# Altium schematic sheet ADS8686S_BLOCK_B.SchDoc
size A4; SheetNumber: 13; SheetTotal: 14
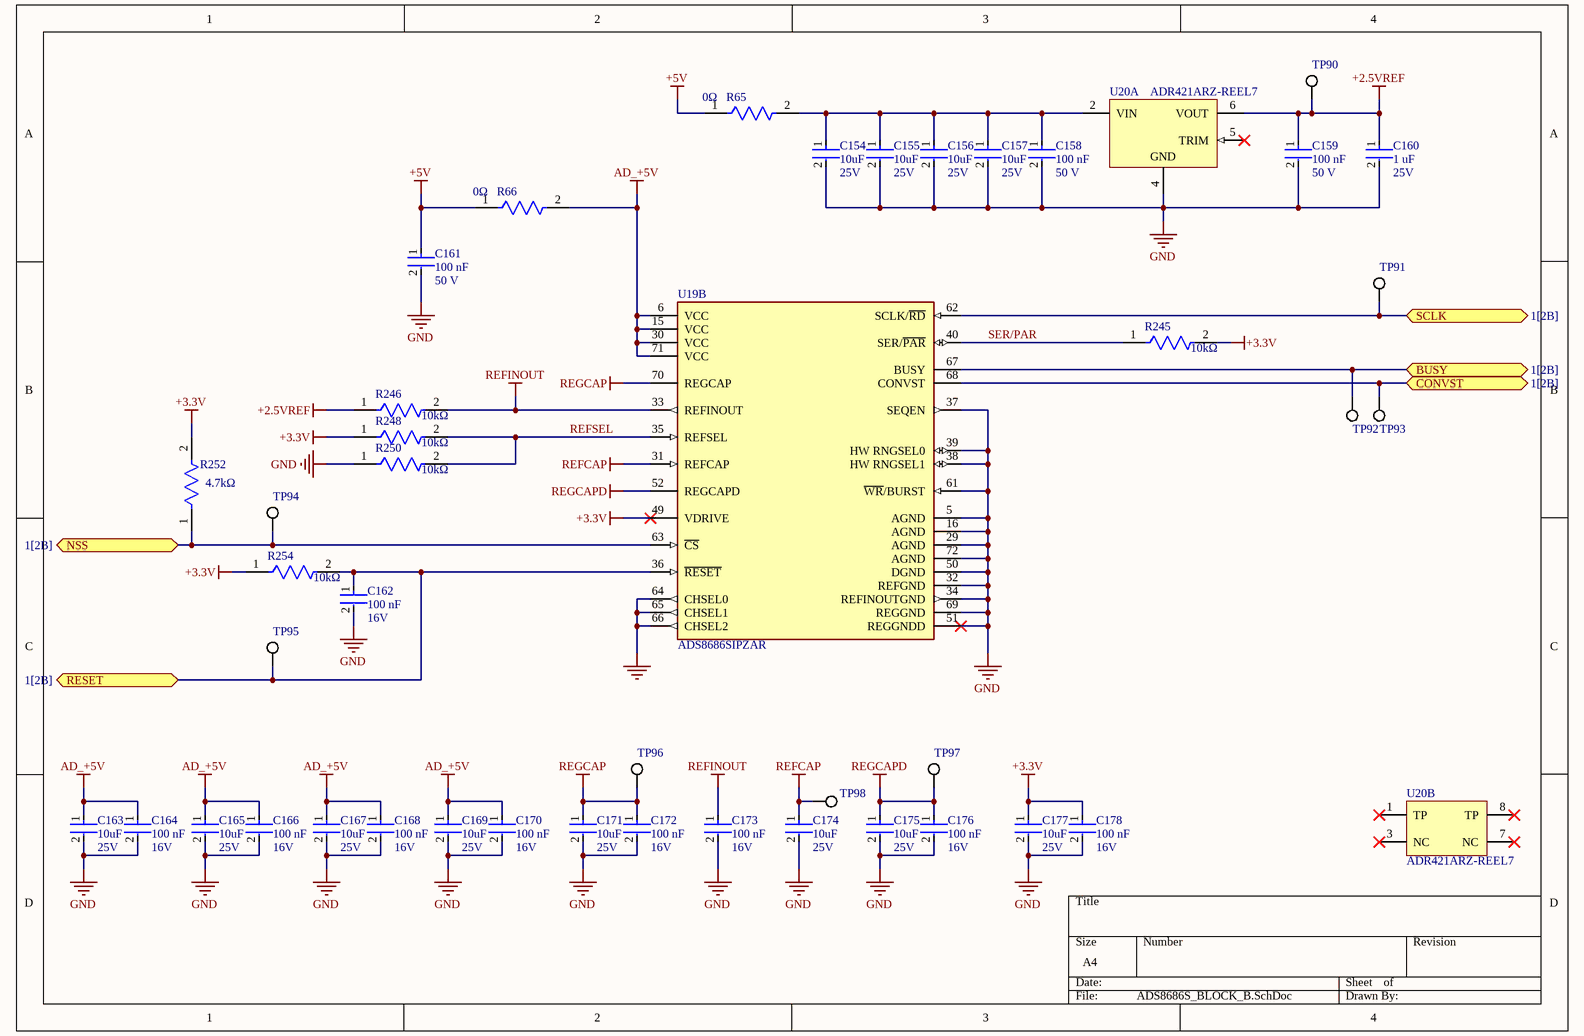
[diagram p0: ADS8686S_BLOCK_B.SchDoc]

## Parts
C154  Voltage Rating: 25V  Capacitance: 10uF  [FP-C1608-080-IPC_B]  (hidden comment: C1608X5R1E106M080AC)
C155  Voltage Rating: 25V  Capacitance: 10uF  [FP-C1608-080-IPC_B]  (hidden comment: C1608X5R1E106M080AC)
C156  Voltage Rating: 25V  Capacitance: 10uF  [FP-C1608-080-IPC_B]  (hidden comment: C1608X5R1E106M080AC)
C157  Voltage Rating: 25V  Capacitance: 10uF  [FP-C1608-080-IPC_B]  (hidden comment: C1608X5R1E106M080AC)
C158  value 100 nF  Voltage Rating: 50 V  [FP-C0603C-CF-IPC_B]  (hidden comment: C0603C104M5RACTU)
C159  value 100 nF  Voltage Rating: 50 V  [FP-C0603C-CF-IPC_B]  (hidden comment: C0603C104M5RACTU)
C160  Capacitance: 1 uF  Voltage Rating: 25V  [FP-GCM188-0_1-IPC_B]  (hidden comment: GCM188R71E105KA64D)
C161  value 100 nF  Voltage Rating: 50 V  [FP-C0603C-CF-IPC_B]  (hidden comment: C0603C104M5RACTU)
C162  Capacitance: 100 nF  Voltage Rating: 16V  [FP-CL752-IPC_B]  (hidden comment: CL05B104KO5VPNC)
C163  Voltage Rating: 25V  Capacitance: 10uF  [FP-C1608-080-IPC_B]  (hidden comment: C1608X5R1E106M080AC)
C164  Capacitance: 100 nF  Voltage Rating: 16V  [FP-CL752-IPC_B]  (hidden comment: CL05B104KO5VPNC)
C165  Voltage Rating: 25V  Capacitance: 10uF  [FP-C1608-080-IPC_B]  (hidden comment: C1608X5R1E106M080AC)
C166  Capacitance: 100 nF  Voltage Rating: 16V  [FP-CL752-IPC_B]  (hidden comment: CL05B104KO5VPNC)
C167  Voltage Rating: 25V  Capacitance: 10uF  [FP-C1608-080-IPC_B]  (hidden comment: C1608X5R1E106M080AC)
C168  Capacitance: 100 nF  Voltage Rating: 16V  [FP-CL752-IPC_B]  (hidden comment: CL05B104KO5VPNC)
C169  Voltage Rating: 25V  Capacitance: 10uF  [FP-C1608-080-IPC_B]  (hidden comment: C1608X5R1E106M080AC)
C170  Capacitance: 100 nF  Voltage Rating: 16V  [FP-CL752-IPC_B]  (hidden comment: CL05B104KO5VPNC)
C171  Voltage Rating: 25V  Capacitance: 10uF  [FP-C1608-080-IPC_B]  (hidden comment: C1608X5R1E106M080AC)
C172  Capacitance: 100 nF  Voltage Rating: 16V  [FP-CL752-IPC_B]  (hidden comment: CL05B104KO5VPNC)
C173  Capacitance: 100 nF  Voltage Rating: 16V  [FP-CL752-IPC_B]  (hidden comment: CL05B104KO5VPNC)
C174  Voltage Rating: 25V  Capacitance: 10uF  [FP-C1608-080-IPC_B]  (hidden comment: C1608X5R1E106M080AC)
C175  Voltage Rating: 25V  Capacitance: 10uF  [FP-C1608-080-IPC_B]  (hidden comment: C1608X5R1E106M080AC)
C176  Capacitance: 100 nF  Voltage Rating: 16V  [FP-CL752-IPC_B]  (hidden comment: CL05B104KO5VPNC)
C177  Voltage Rating: 25V  Capacitance: 10uF  [FP-C1608-080-IPC_B]  (hidden comment: C1608X5R1E106M080AC)
C178  Capacitance: 100 nF  Voltage Rating: 16V  [FP-CL752-IPC_B]  (hidden comment: CL05B104KO5VPNC)
R65  Resistance: 0Ω  [FP-CRCW0603-HPe3-IPC_B]  (hidden comment: CRCW06030000Z0EAHP)
R66  Resistance: 0Ω  [FP-CRCW0603-HPe3-IPC_B]  (hidden comment: CRCW06030000Z0EAHP)
R245  Resistance: 10kΩ  [FP-RC0603-0_55-IPC_B]  (hidden comment: RC0603FR-0710KL)
R246  Resistance: 10kΩ  [FP-RC0603-0_55-IPC_B]  (hidden comment: RC0603FR-0710KL)
R248  Resistance: 10kΩ  [FP-RC0603-0_55-IPC_B]  (hidden comment: RC0603FR-0710KL)
R250  Resistance: 10kΩ  [FP-RC0603-0_55-IPC_B]  (hidden comment: RC0603FR-0710KL)
R252  Resistance: 4.7kΩ  [FP-AC0603-IPC_B]  (hidden comment: AC0603FR-074K7L)
R254  Resistance: 10kΩ  [FP-RC0603-0_55-IPC_B]  (hidden comment: RC0603FR-0710KL)
TP90  5019  [KSTN-5019_V]  (value not drawn)
TP91  5019  [KSTN-5019_V]  (value not drawn)
TP92  5019  [KSTN-5019_V]  (value not drawn)
TP93  5019  [KSTN-5019_V]  (value not drawn)
TP94  5019  [KSTN-5019_V]  (value not drawn)
TP95  5019  [KSTN-5019_V]  (value not drawn)
TP96  5019  [KSTN-5019_V]  (value not drawn)
TP97  5019  [KSTN-5019_V]  (value not drawn)
TP98  5019  [KSTN-5019_V]  (value not drawn)
U19  ADS8686SIPZAR  [TI-RECOMMENDED]  (part B of 2)
U20  ADR421ARZ-REEL7  [ADI-R-8_M]  (parts A,B of 2)

## Ports
BUSY (bidir, see 1[2B]), CONVST (bidir, see 1[2B]), NSS (bidir, see 1[2B]), RESET (bidir, see 1[2B]), SCLK (bidir, see 1[2B])

## Nets
+2.5VREF: C159.1 C160.1 R246.1 TP90.1 U20.6(VOUT)
+3.3V: C177.1 C178.1 R245.2 R248.1 R252.2 R254.1 U19.49(VDRIVE)
+5V: C161.1 R65.1 R66.1
AD_+5V: C163.1 C164.1 C165.1 C166.1 C167.1 C168.1 C169.1 C170.1 R66.2 U19.6(VCC) U19.15(VCC) U19.30(VCC) U19.71(VCC)
GND: C154.2 C155.2 C156.2 C157.2 C158.2 C159.2 C160.2 C161.2 C162.2 C163.2 C164.2 C165.2 C166.2 C167.2 C168.2 C169.2 C170.2 C171.2 C172.2 C173.2 C174.2 C175.2 C176.2 C177.2 C178.2 R250.1 U19.5(AGND) U19.16(AGND) U19.29(AGND) U19.32(REFGND) U19.34(REFINOUTGND) U19.37(SEQEN) U19.38(HW_RNGSEL1) U19.39(HW_RNGSEL0) U19.50(DGND) U19.51(REGGNDD) U19.61(~{WR}/BURST) U19.64(CHSEL0) U19.65(CHSEL1) U19.66(CHSEL2) U19.69(REGGND) U19.72(AGND) U20.4(GND)
REFCAP: C174.1 TP98.1 U19.31(REFCAP)
REFINOUT: C173.1 R246.2 U19.33(REFINOUT)
REGCAP: C171.1 C172.1 TP96.1 U19.70(REGCAP)
REGCAPD: C175.1 C176.1 TP97.1 U19.52(REGCAPD)
BUSY: TP92.1 U19.67(BUSY) ; port BUSY
CONVST: TP93.1 U19.68(CONVST) ; port CONVST
NSS: R252.1 TP94.1 U19.63(~{CS}) ; port NSS
REFSEL: R248.2 R250.2 U19.35(REFSEL)
RESET: C162.1 R254.2 TP95.1 U19.36(~{RESET}) ; port RESET
SCLK: TP91.1 U19.62(SCLK/~{RD}) ; port SCLK
SER/PAR: R245.1 U19.40(SER/~{PAR})
NetC154_1: C154.1 C155.1 C156.1 C157.1 C158.1 R65.2 U20.2(VIN)

Not connected (* = marked no-connect by the designer): U20 1(TP)* 3(NC)* 5(TRIM)* 7(NC)* 8(TP)*

## Library data of the parts
C154-C157 C163 C165 C167 C169 C171 C174 C175 C177 = CMP-2000-05442-2: CAP CER 10UF 25V X5R 0603; Dielectric Material: Ceramic; Tolerance: 20%; Dielectric: X5R; Length: 1.6mm; Termination: SMD/SMT; Depth: 0.8mm; RoHS Compliant: Yes; Construction: Flat; Weight: 7.1E-05oz; Thickness: 0.039inch; Packaging: Tape and Reel; Min Operating Temperature: -55°C; Case Code (Imperial): 0603; Case/Package: 0603; Height: 0.8mm; Case Code (Metric): 1608; Resistor Type: Ceramic; Voltage Rating (DC): 25V; Max Operating Temperature: 85°C; REACH SVHC: No SVHC; Lead Free: Lead Free; Series: C; Width: 0.8mm; Mount: Surface Mount; Package Quantity: 1
C158 C159 C161 = CMP-2006-03068-2: CAP CER 0.1UF 50V 20% X7R 0603; Manufacturer: KEMET; Material: Ceramic; Tolerance: 0.2; Temperature Coefficient: 30ppm/°C; Automotive Grade: Grade 1; Capacitance: 0.10 μF; Temperature Range High: +125°C; Device Class L3: Ceramic Capacitors; Manufacturer Part Number: C0603C104M5RACTU; Height: 0.87mm; Category: Cap; RoHS: TRUE; Digikey Description: CAP CER 0.1UF 50V 20% X7R 0603; ComponentLink2URL: https://api.kemet.com/component-edge/download/datasheet/C0603C100J5GACAUTO.pdf; Lead Free: Yes; Temperature Range Low: -55°C; Device Class L1: Passive Components; ComponentLink2Description: Datasheet; Temperature Characteristic: X7R; Automotive: Yes; Temperature: -55°C to +125°C; Octopart: https://octopart.com/c0603c104m5ractu-kemet-11855687; Device Class L2: Capacitors; Package: C0603C-CF; Mouser Description: Multilayer Ceramic Capacitors MLCC - SMD/SMT 50volts 0.1uF X7R 20%
C160 = CMP-2006-02363-4: Manufacturer Lifecycle Status: IN PRODUCTION; NexarPartId: 18909256; Dielectric: X7R; Material: Ceramic; Tolerance: 10%; Thickness: 889µm; Max Operating Temperature: 125°C; Radiation Hardening: No; Weight: 6.293594mg; Lead Free: Lead Free; Mount: Surface Mount; Case Code (Imperial): 0603; REACH SVHC: No SVHC; Lifecycle Status: Production; Depth: 800µm; Min Operating Temperature: -55°C; Height: 800µm; Case Code (Metric): 1608; Case/Package: 0603; Voltage: 25V; Packaging: Cut Tape; Length: 1.6mm; Termination: SMD/SMT; Width: 787.4µm; Voltage Rating (DC): 25V; RoHS: Compliant; Schedule B: 8532240020, 8532240020; Ratings: AEC-Q200
C162 C164 C166 C168 C170 C172 C173 C176 C178 = CMP-13271-002128-1: Cap Ceramic 100nF 16V X7R ±10% SMD 0402 +125°C Paper T/R; Length: 0.039inch; Case Code (Metric): 1005; Thickness: 0.022inch; Max Operating Temperature: 125°C; Mount: Surface Mount; Features: Soft Termination; Width: 0.02inch; Min Operating Temperature: -55°C; Tolerance: 10%; Case/Package: 0402; Packaging: Cut Tape; Ratings: AEC-Q200; Case Code (Imperial): 0402; Lead Free: Lead Free
R65 R66 = CMP-2000-03817-2: RES Thick Film, 0Ω, , 0.33W, , 0603; Max Power Dissipation: 250mW; Voltage Rating (DC): 75V; Temperature Coefficient: 0ppm/°C; Mount: Surface Mount; Package Quantity: 5000; Features: Automotive AEC-Q200; Length: 1.6mm; Width: 0.033inch; Min Operating Temperature: -55°C; Max Operating Temperature: 155°C; Contact Plating: Tin; Depth: 0.85mm; Case/Package: 0603; Radiation Hardening: No; Military Standard: Not; Power Rating: 250mW; Height: 0.45mm; Composition: Thick Film; Lead Free: Lead Free; Voltage Rating: 75V; Case Code (Imperial): 0603; Weight: 7.1E-05oz; Number of Terminations: 2; Packaging: Tape and Reel; Number of Pins: 2; Case Code (Metric): 1608; Termination: SMD/SMT
R245 R246 R248 R250 R254 = CMP-2100-03664-2: RES 10K OHM 1% 1/10W 0603; Voltage Rating: 75V; Voltage Rating (DC): 50V; Power Rating: 100mW; Temperature Coefficient: 100ppm/°C; Depth: 0.8mm; Termination: SMD/SMT; Resistor Type: Thick Film; Series: RC; Construction: Rectangular; Features: Moisture Resistant; Packaging: Tape and Reel; Min Operating Temperature: -55°C; Number of Terminations: 2; Lead Pitch: 0.3mm; RoHS Compliant: Yes; Case/Package: 0603; Resistance Tolerance: 1%; Military Standard: Not; Weight: 7.1E-05oz; Number of Pins: 2; Tolerance: 1%; Length: 1.6mm; Case Code (Imperial): 0603; Lead Free: Lead Free; Width: 0.8mm; Max Power Dissipation: 100mW; Height: 0.45mm; Max Operating Temperature: 155°C; Case Code (Metric): 1608; Size Code: 0603
R252 = CMP-2000-04847-3: RES 4.7KΩ 1.00% 0.1W 0603; Temperature Coefficient: 100ppm/°C; Max Power Dissipation: 100mW; Voltage Rating: 50V; Tolerance: 1%; Min Operating Temperature: -55°C; Width: 0.031inch; Features: Moisture Resistant; Case/Package: 0603; Number of Terminations: 2; Height: 0.022inch; Case Code (Imperial): 0603; Construction: Rectangular; Length: 0.063inch; Termination: SMD/SMT; Military Standard: Not; Case Code (Metric): 1608; Lead Free: Lead Free; Depth: 0.8mm; Max Operating Temperature: 155°C; Size Code: 0603; RoHS Compliant: Yes; Series: AC; Resistor Type: Thick Film; Ratings: AEC-Q200; Packaging: Tape and Reel; Power Rating: 100mW
TP90-TP98 = CMP-1672-00008-1: Test Point, 1 Position SMD, RoHS, Tape and Reel; ComponentLink1Description: Manufacturer URL; Package Quantity: 1000; DatasheetVersion: 03/2014; Packaging: Tape and Reel; ComponentLink2URL: http://www.keyelco.com/product-pdf.cfm?p=1357; ComponentLink1URL: http://www.keyelco.com/; Mount: Surface Mount; Contact Plating: Silver; PackageDescription: 1-Pin Surface Mount Device, Body 3.81 x 2.03 mm; Pins: 1; RoHSCompliant: True; Mounting Technology: Surface Mount; ComponentLink2Description: Datasheet; PackageReference: 5019
U19 = ADS8686SIPZAR: 16-channel 16-bit 1-MSPS dual simultaneous-sampling ADC with integrated analog front end (AFE) 80-LQFP -40 to 125; Manufacturer: Texas Instruments; Supplier: Mouser; Supplier Part Number: 595-ADS8686SIPZAR; Manufacturer Part Number: ADS8686SIPZAR; RoHS: Yes; Category: Analog to Digital Converters (ADCs); Stock: 975; Pricing: 1=20.61, 10=19.01, 50=18.16, 100=16.24, 1000=13.88, 10000=13.88 (USD); RoHS Compliant: Yes; Supplier 1: Mouser; Supplier Part Number 1: 595-ADS8686SIPZAR
U20 = CMP-0784-00215-1: Ultraprecision, Low Noise, XFET(R) Voltage Reference, 2.5 V Output, 4.5 to 18 V Supply, Industrial, 8-pin SOIC (R-8), Reel; Manufacturer: Analog Devices; Vout: 2.5V; Max V Supply (V): 18; Min V Supply (V): 4.5; Ref Out TC (ppm/C): 2; Mounting Technology: Surface Mount; ComponentLink4URL: Product URL:http://www.analog.com/en/special-linear-functions/voltage-references/adr421/products/product.html; ComponentLink2Description: Datasheet; Code_JEDEC: MS-012-AA; ComponentLink3Description: Package Specification; ComponentLink1Description: Manufacturer URL; PackageVersion: 060506-A, 06/2006; ComponentLink4Description: URL Link1; PackageReference: R-8; ComponentLink3URL: http://www.analog.com/static/imported-files/packages/PKG_PDF/SOIC_Narrow%20(R)/R_8.pdf; Operating Temp Range: -40 to 125 degC; Packing: Reel; DatasheetVersion: Rev. I; PartNumber: ADR421ARZ-REEL7; ComponentLink2URL: http://www.analog.com/static/imported-files/data_sheets/ADR420_421_423_425.pdf; ComponentLink1URL: http://www.analog.com/en/index.html; PackageDescription: 8-Pin Standard Small Outline Package, Body 4.9 x 3.9 mm, Pitch 1.27 mm